# EAGLE design W500A (EAGLE 6.6.0)
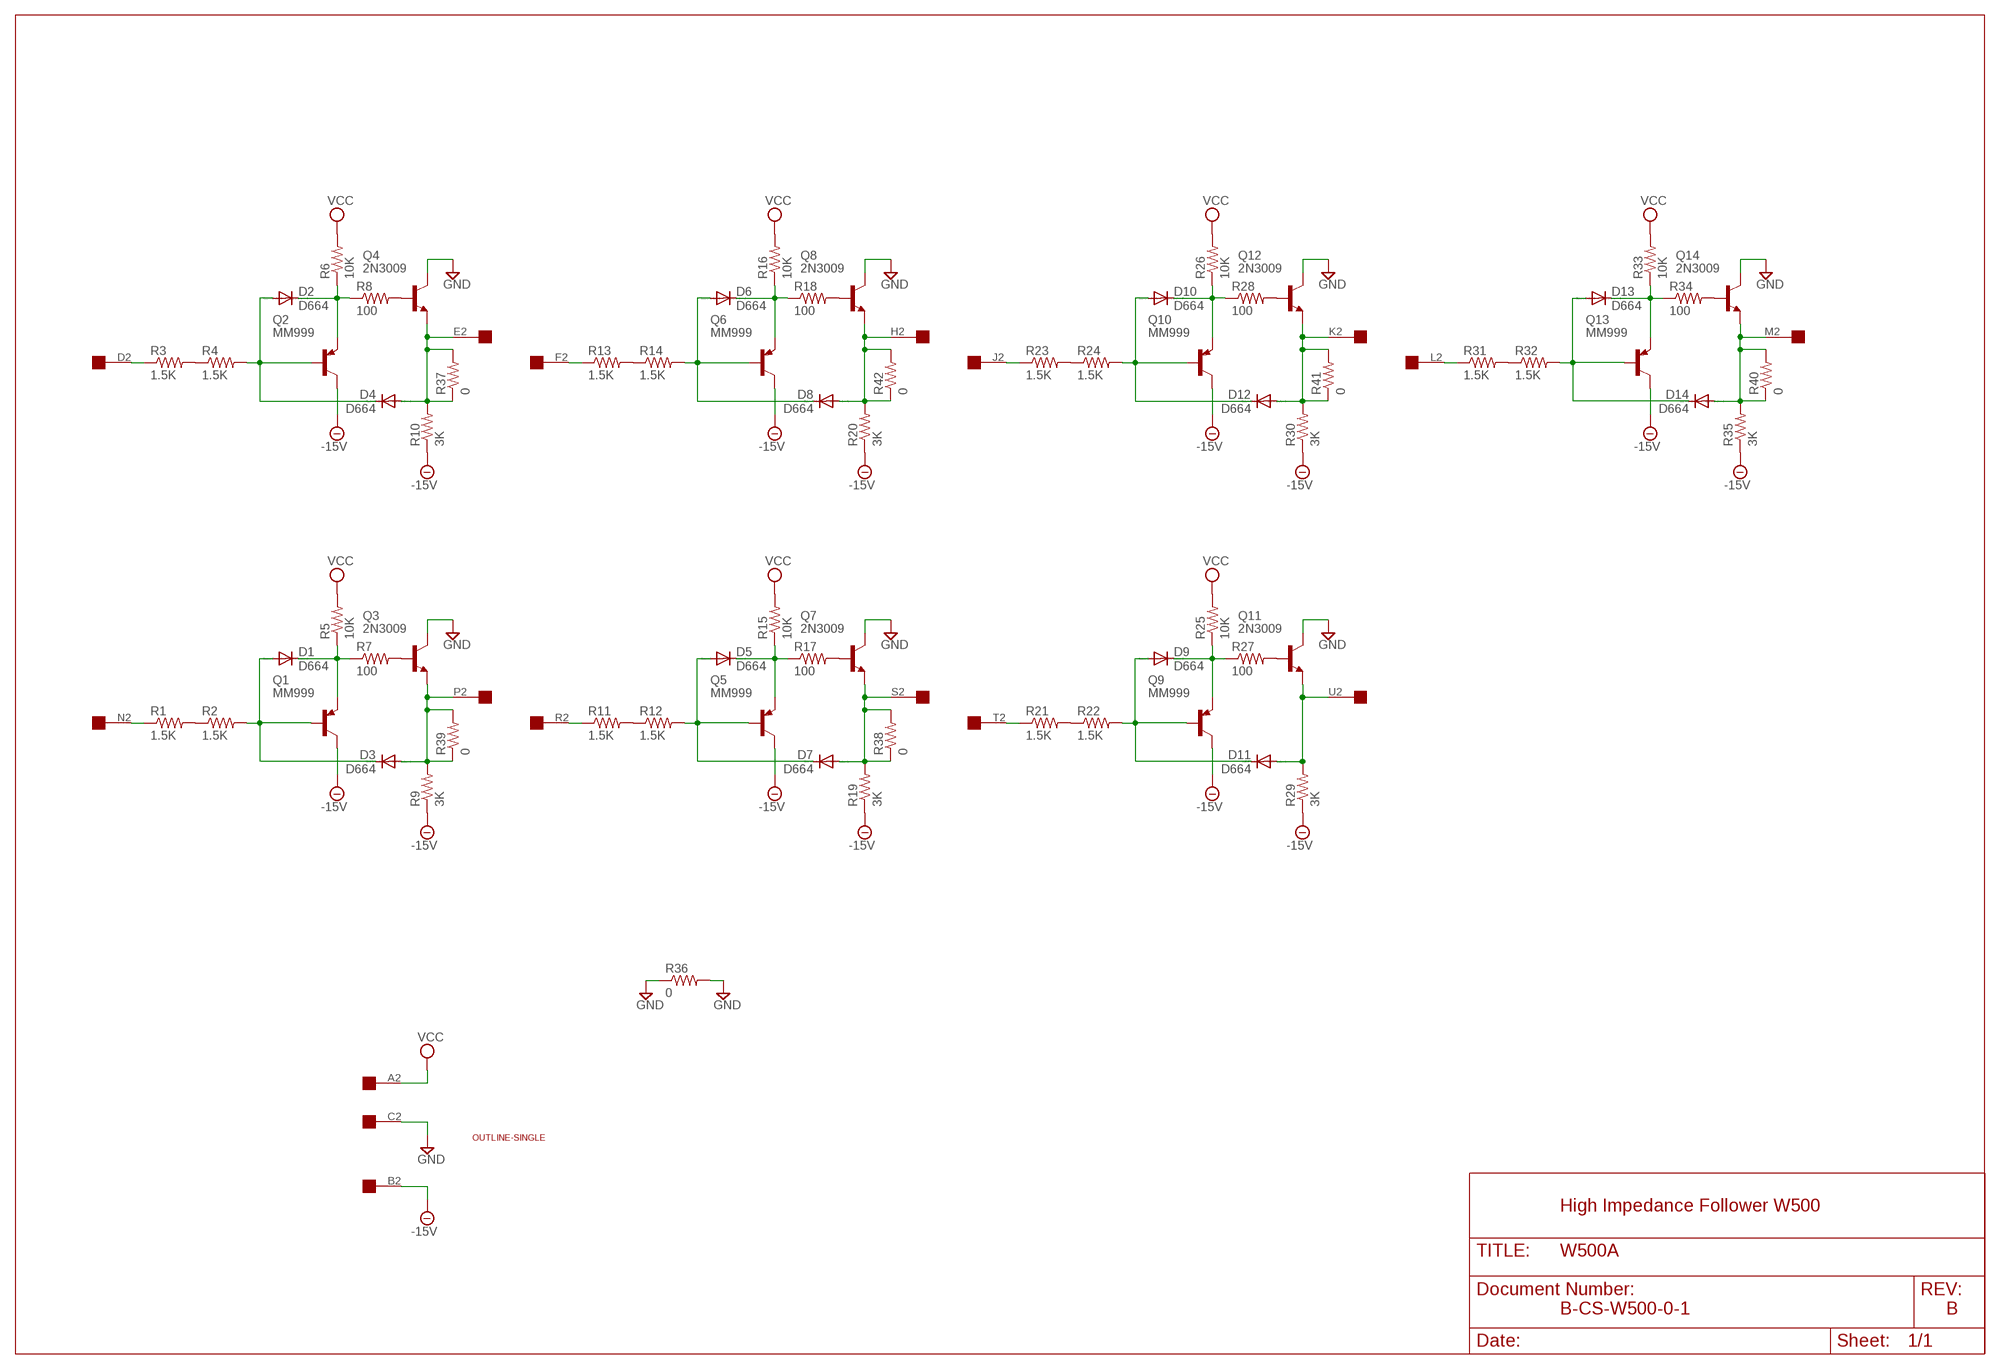
[diagram p0: schematic, sheet 1]

## Parts
D1  D664  DIODE-DO35-10  [DO35-10]
D2  D664  DIODE-DO35-10  [DO35-10]
D3  D664  DIODE-DO35-10  [DO35-10]
D4  D664  DIODE-DO35-10  [DO35-10]
D5  D664  DIODE-DO35-10  [DO35-10]
D6  D664  DIODE-DO35-10  [DO35-10]
D7  D664  DIODE-DO35-10  [DO35-10]
D8  D664  DIODE-DO35-10  [DO35-10]
D9  D664  DIODE-DO35-10  [DO35-10]
D10  D664  DIODE-DO35-10  [DO35-10]
D11  D664  DIODE-DO35-10  [DO35-10]
D12  D664  DIODE-DO35-10  [DO35-10]
D13  D664  DIODE-DO35-10  [DO35-10]
D14  D664  DIODE-DO35-10  [DO35-10]
Q1  MM999  -PNP-TO5  [TO5]
Q2  MM999  -PNP-TO5  [TO5]
Q3  2N3009  -NPN-TO5  [TO5]
Q4  2N3009  -NPN-TO5  [TO5]
Q5  MM999  -PNP-TO5  [TO5]
Q6  MM999  -PNP-TO5  [TO5]
Q7  2N3009  -NPN-TO5  [TO5]
Q8  2N3009  -NPN-TO5  [TO5]
Q9  MM999  -PNP-TO5  [TO5]
Q10  MM999  -PNP-TO5  [TO5]
Q11  2N3009  -NPN-TO5  [TO5]
Q12  2N3009  -NPN-TO5  [TO5]
Q13  MM999  -PNP-TO5  [TO5]
Q14  2N3009  -NPN-TO5  [TO5]
R1  1.5K  R-US_0207/10  [0207/10]
R2  1.5K  R-US_0207/10  [0207/10]
R3  1.5K  R-US_0207/10  [0207/10]
R4  1.5K  R-US_0207/10  [0207/10]
R5  10K  R-US_0207/10  [0207/10]
R6  10K  R-US_0207/10  [0207/10]
R7  100  R-US_0207/10  [0207/10]
R8  100  R-US_0207/10  [0207/10]
R9  3K  R-US_0207/10  [0207/10]
R10  3K  R-US_0207/10  [0207/10]
R11  1.5K  R-US_0207/10  [0207/10]
R12  1.5K  R-US_0207/10  [0207/10]
R13  1.5K  R-US_0207/10  [0207/10]
R14  1.5K  R-US_0207/10  [0207/10]
R15  10K  R-US_0207/10  [0207/10]
R16  10K  R-US_0207/10  [0207/10]
R17  100  R-US_0207/10  [0207/10]
R18  100  R-US_0207/10  [0207/10]
R19  3K  R-US_0207/10  [0207/10]
R20  3K  R-US_0207/10  [0207/10]
R21  1.5K  R-US_0207/10  [0207/10]
R22  1.5K  R-US_0207/10  [0207/10]
R23  1.5K  R-US_0207/10  [0207/10]
R24  1.5K  R-US_0207/10  [0207/10]
R25  10K  R-US_0207/10  [0207/10]
R26  10K  R-US_0207/10  [0207/10]
R27  100  R-US_0207/10  [0207/10]
R28  100  R-US_0207/10  [0207/10]
R29  3K  R-US_0207/10  [0207/10]
R30  3K  R-US_0207/10  [0207/10]
R31  1.5K  R-US_0207/10  [0207/10]
R32  1.5K  R-US_0207/10  [0207/10]
R33  10K  R-US_0207/10  [0207/10]
R34  100  R-US_0207/10  [0207/10]
R35  3K  R-US_0207/10  [0207/10]
R36  0  R-US_0207/10  [0207/10]
R37  0  R-US_0207/10  [0207/10]
R38  0  R-US_0207/10  [0207/10]
R39  0  R-US_0207/10  [0207/10]
R40  0  R-US_0207/10  [0207/10]
R41  0  R-US_0207/10  [0207/10]
R42  0  R-US_0207/10  [0207/10]
U$1  OUTLINE-SINGLE  [SINGLE]
U$2  EDGE-1  [EDGE-CON1]

## Nets
-15V: Q1.3(C) Q2.3(C) Q5.3(C) Q6.3(C) Q9.3(C) Q10.3(C) Q13.3(C) R9.1 R10.1 R19.1 R20.1 R29.1 R30.1 R35.1 U$2.B2
GND: Q3.3(C) Q4.3(C) Q7.3(C) Q8.3(C) Q11.3(C) Q12.3(C) Q14.3(C) R36.1 R36.2 U$2.C2
N$1: D2.C Q2.1(E) R6.1 R8.1
N$2: D2.A D4.C Q2.2(B) R4.2
N$3: R3.2 R4.1
N$4: R3.1 U$2.D2
N$5: Q4.2(B) R8.2
N$6: D4.A Q4.1(E) R10.2 R37.1 R37.2 U$2.E2
N$7: R1.2 R2.1
N$8: R1.1 U$2.N2
N$9: D1.A D3.C Q1.2(B) R2.2
N$10: D1.C Q1.1(E) R5.1 R7.1
N$11: D3.A Q3.1(E) R9.2 R39.1 R39.2 U$2.P2
N$12: Q3.2(B) R7.2
N$13: D6.C Q6.1(E) R16.1 R18.1
N$14: D6.A D8.C Q6.2(B) R14.2
N$15: R13.2 R14.1
N$16: R13.1 U$2.F2
N$17: Q8.2(B) R18.2
N$18: D8.A Q8.1(E) R20.2 R42.1 R42.2 U$2.H2
N$19: R11.2 R12.1
N$20: R11.1 U$2.R2
N$21: D5.A D7.C Q5.2(B) R12.2
N$22: D5.C Q5.1(E) R15.1 R17.1
N$23: D7.A Q7.1(E) R19.2 R38.1 R38.2 U$2.S2
N$24: Q7.2(B) R17.2
N$25: D10.C Q10.1(E) R26.1 R28.1
N$26: D10.A D12.C Q10.2(B) R24.2
N$27: R23.2 R24.1
N$28: R23.1 U$2.J2
N$29: Q12.2(B) R28.2
N$30: D12.A Q12.1(E) R30.2 R41.1 R41.2 U$2.K2
N$31: R21.2 R22.1
N$33: D9.A D11.C Q9.2(B) R22.2
N$34: D9.C Q9.1(E) R25.1 R27.1
N$35: D11.A Q11.1(E) R29.2 U$2.U2
N$36: Q11.2(B) R27.2
N$37: R21.1 U$2.T2
N$43: R31.2 R32.1
N$44: R31.1 U$2.L2
N$45: D13.A D14.C Q13.2(B) R32.2
N$46: D13.C Q13.1(E) R33.1 R34.1
N$47: D14.A Q14.1(E) R35.2 R40.1 R40.2 U$2.M2
N$48: Q14.2(B) R34.2
VCC: R5.2 R6.2 R15.2 R16.2 R25.2 R26.2 R33.2 U$2.A2
Unconnected: U$2.V2

## Notes on the sheet
- High Impedance Follower W500
- B-CS-W500-0-1 | B

## Library data of the parts
D1-D14 = diode:DIODE-: DIODE
Q1 Q2 Q5 Q6 Q9 Q10 Q13 = transistor:*-PNP-: PNP Transistror
Q3 Q4 Q7 Q8 Q11 Q12 Q14 = transistor:*-NPN-: NPN Transistror BF959 corrected 2008.03.06
R1-R42 = rcl:R-US_: RESISTOR, American symbol
U$1 = dec-con:OUTLINE-*: Board outlines for DEC boards.
U$2 = dec-con:EDGE-1: Single-Sided DEC Edge Connector -- (side 2)

## Board
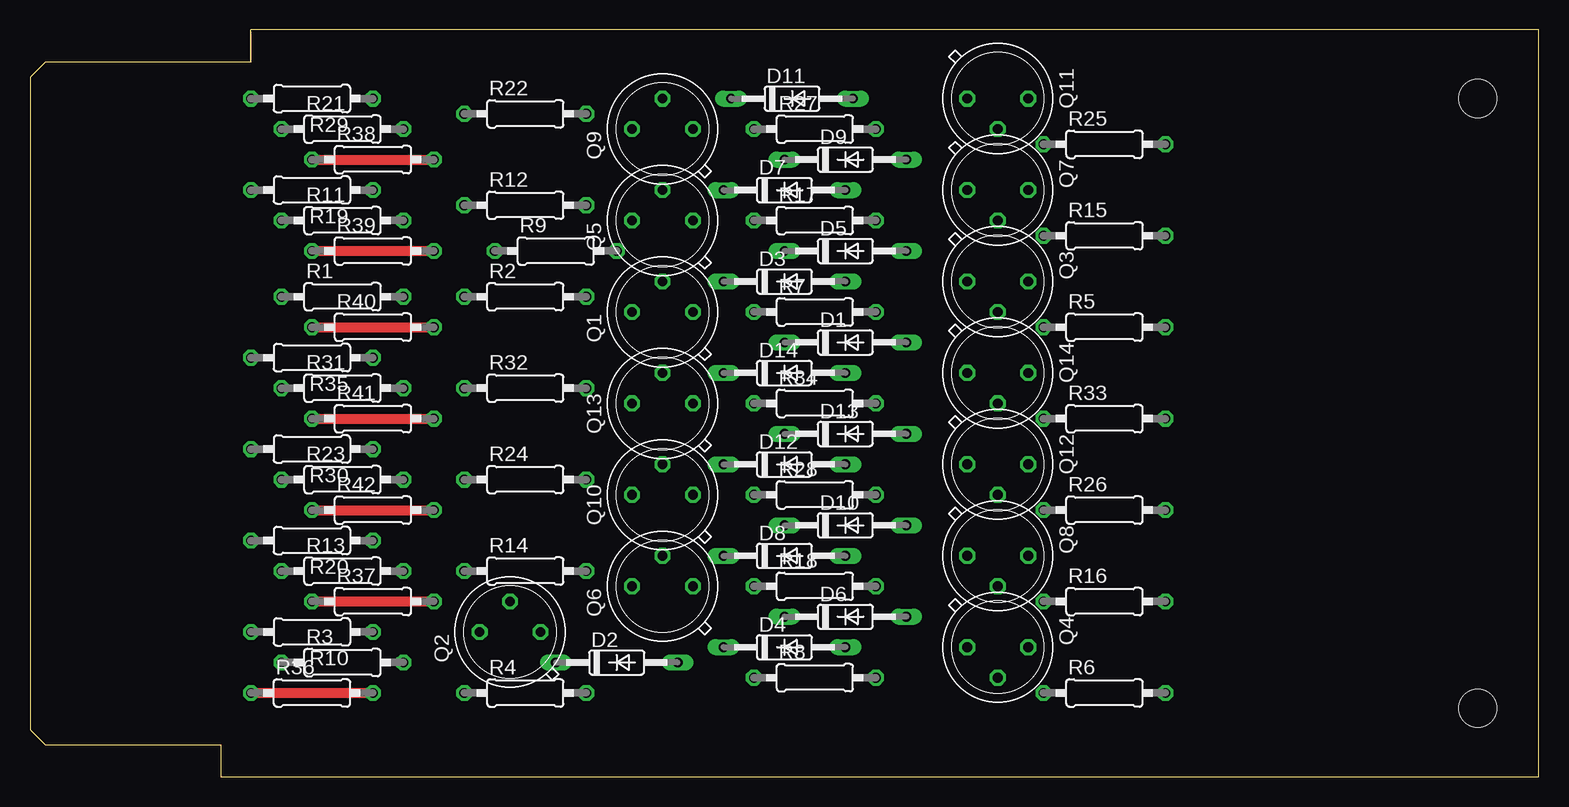
[diagram p1: board, top side]
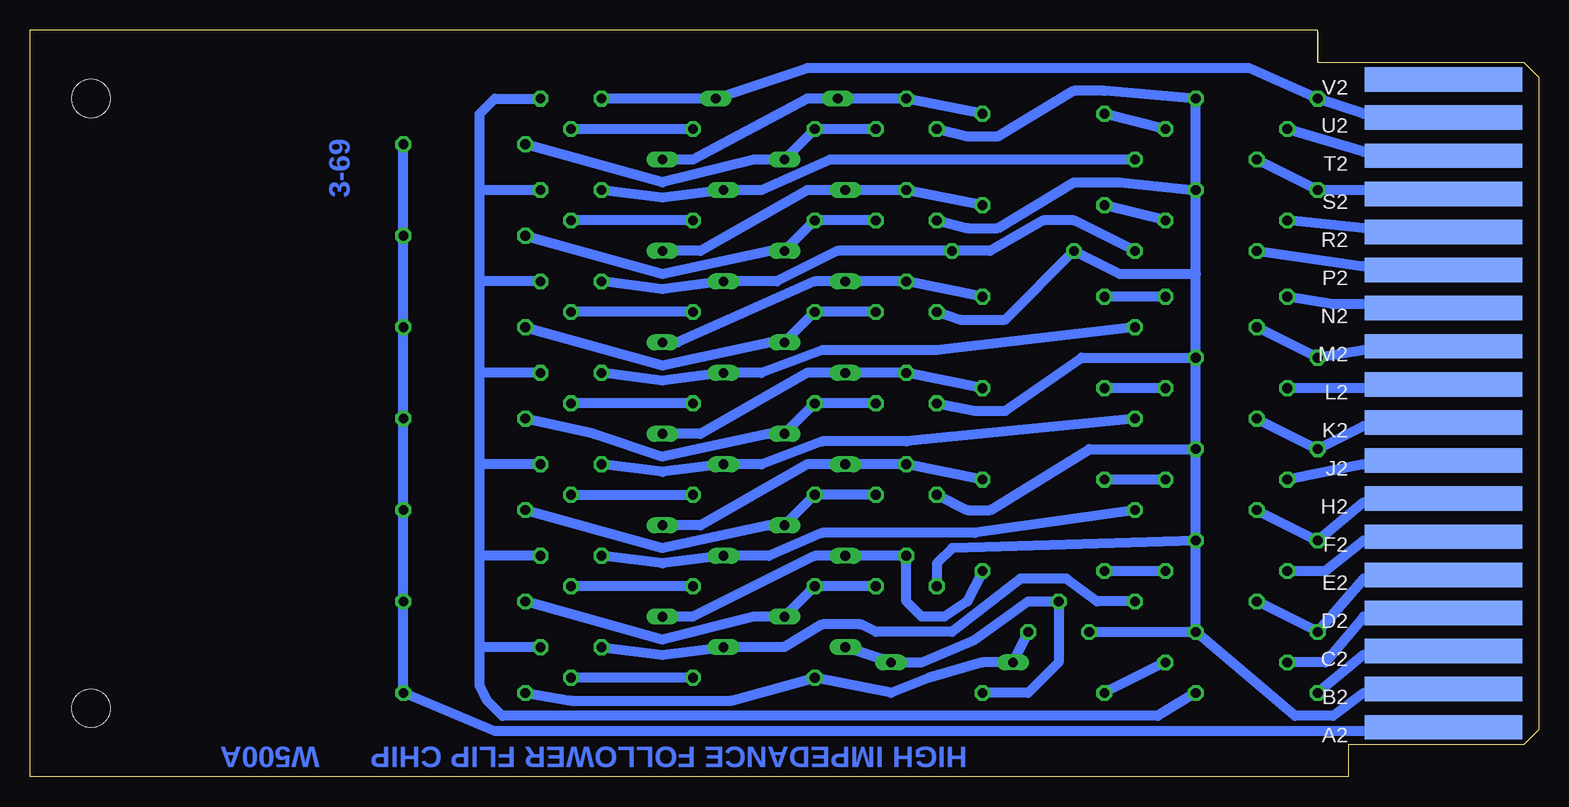
[diagram p2: board, bottom side, seen from below]

Size 125.73 x 62.23 mm. Coordinates in mm from the lower left corner, seen from the top.
Copper layers (1+16): Top 0.035mm / dielectric 1.5mm / Bottom 0.035mm
Design rules "16mils": minimum track width 16mil, minimum drill 32mil, track to track 15mil, track to pad 10mil, pad to pad 10mil, via to via 10mil, smd to smd 10mil, copper to edge 13mil, drill to drill 10mil, minimum pad ring 10mil, minimum via ring 8mil, stop-mask expansion 0mil, vias tented up to drill 0mil, thermal gap 10mil

### Footprints (pad centres in the part's own frame; a part is rotated, then mirrored left to right if it is on the bottom)
DO35-10 = drill 0.813 long: A 5.08,0; C -5.08,0
TO5 = drill 0.813 octagon: 1 0,-2.54; 2 2.54,0; 3 0,2.54
0207/10 = drill 0.813 octagon: 1 -5.08,0; 2 5.08,0
SINGLE = hole 3.175: 120.65,56.515; 120.65,5.715
EDGE-CON1 = smd 13.106 x 2.032 bottom: A2 7.938,4.128; B2 7.938,7.303; C2 7.938,10.477; D2 7.938,13.652; E2 7.938,16.828; F2 7.938,20.003; H2 7.938,23.177; J2 7.938,26.352; K2 7.938,29.527; L2 7.938,32.703; M2 7.938,35.877; N2 7.938,39.053; P2 7.938,42.227; R2 7.938,45.403; S2 7.938,48.578; T2 7.938,51.752; U2 7.938,54.928; V2 7.938,58.102

### Placement (x,y rotation side)
D1  67.95,36.2 0 top
D2  48.9,9.53 0 top
D3  62.87,41.27 0 top
D4  62.87,10.79 0 top
D5  67.95,43.81 0 top
D6  67.95,13.34 0 top
D7  62.87,48.9 0 top
D8  62.87,18.41 0 top
D9  67.95,51.44 0 top
D10  67.95,20.95 0 top
D11  63.5,56.52 0 top
D12  62.87,26.04 0 top
D13  67.95,28.57 0 top
D14  62.87,33.66 0 top
Q1  52.71,38.73 90 top
Q2  40.01,12.06 90 top
Q3  80.65,41.27 270 top
Q4  80.65,10.79 270 top
Q5  52.71,46.35 90 top
Q6  52.71,15.88 90 top
Q7  80.65,48.9 270 top
Q8  80.65,18.41 270 top
Q9  52.71,53.98 90 top
Q10  52.71,23.5 90 top
Q11  80.65,56.52 270 top
Q12  80.65,26.04 270 top
Q13  52.71,31.11 90 top
Q14  80.65,33.66 270 top
R1  26.04,40.01 0 top
R2  41.28,40.01 0 top
R3  26.04,9.53 0 top
R4  41.28,6.99 0 top
R5  89.54,37.47 0 top
R6  89.54,6.99 0 top
R7  65.41,38.73 0 top
R8  65.41,8.26 0 top
R9  43.82,43.81 0 top
R10  23.5,12.06 180 top
R11  26.04,46.35 0 top
R12  41.28,47.62 0 top
R13  26.04,17.14 0 top
R14  41.28,17.14 0 top
R15  89.54,45.09 0 top
R16  89.54,14.61 0 top
R17  65.41,46.35 0 top
R18  65.41,15.88 0 top
R19  23.5,48.9 180 top
R20  23.5,19.68 180 top
R21  26.04,53.98 0 top
R22  41.28,55.24 0 top
R23  26.04,24.77 0 top
R24  41.28,24.77 0 top
R25  89.54,52.7 0 top
R26  89.54,22.23 0 top
R27  65.41,53.98 0 top
R28  65.41,23.5 0 top
R29  23.5,56.52 180 top
R30  23.5,27.3 180 top
R31  26.04,32.38 0 top
R32  41.28,32.38 0 top
R33  89.54,29.84 0 top
R34  65.41,31.11 0 top
R35  23.5,34.92 180 top
R36  23.5,6.99 0 top
R37  28.58,14.61 0 top
R38  28.58,51.44 0 top
R39  28.58,43.81 0 top
R40  28.58,37.47 0 top
R41  28.58,29.84 0 top
R42  28.58,22.23 0 top
U$1  0,0 0 top
U$2  0,0 0 top

### Tracks (layer width: path | path; a pad name or v marks a point on that pad's centre or on a via)
-15V
  Bottom 0.813: U$2.B2 10.8,6.99 14.61,6.99 17.15,5.08 20.32,5.08 R10.1 | Q2.3 R10.1 | R10.1 R20.1 | R20.1 R30.1 | R30.1 R35.1 | R35.1 28.58,41.91 | 28.58,41.91 R19.1 | R19.1 R29.1 36.2,57.15 38.74,57.15 45.09,53.34 47.63,53.34 Q9.3 | Q1.3 48.26,38.1 44.45,38.1 R9.1 34.93,41.91 28.58,41.91 | R20.1 48.9,19.05 50.17,17.78 Q6.3 | Q13.3 46.99,30.48 44.45,30.48 38.1,34.92 R35.1 | Q5.3 47.63,45.72 45.09,45.72 38.74,49.53 34.93,49.53 R19.1 | Q10.3 47.63,22.23 45.72,22.23 37.47,27.3 R30.1
GND
  Top 0.813: R36.1 R36.2
  Bottom 0.813: U$2.C2 8.89,10.16 14.61,10.16 R36.1 | R36.2 31.75,5.08 86.36,5.08 87.63,6.35 88.27,7.62 88.27,10.79 | 88.27,10.79 88.27,18.41 | 88.27,18.41 88.27,26.04 | 88.27,26.04 88.27,33.66 | 88.27,33.66 88.27,41.27 | 88.27,41.27 88.27,48.9 | 88.27,48.9 88.27,55.24 87,56.52 Q11.3 | Q4.3 88.27,10.79 | Q3.3 88.27,41.27 | Q7.3 88.27,48.9 | Q14.3 88.27,33.66 | Q12.3 88.27,26.04 | Q8.3 88.27,18.41
N$1
  Bottom 0.813: Q2.1 D2.C 46.36,9.53 50.8,8.26 53.98,6.99 R8.1 67.31,6.35 80.65,6.35 R6.1
N$2
  Bottom 0.813: R4.2 42.55,6.99 40.01,9.53 Q2.2 42.55,14.61 46.99,11.43 51.44,9.53 D2.A D4.C
N$3
  Bottom 0.813: R3.2 R4.1
N$4
  Bottom 0.813: U$2.D2 8.89,13.34 14.61,13.34 17.78,9.53 R3.1
N$5
  Bottom 0.813: R8.2 Q4.2
N$6
  Top 0.813: R37.1 R37.2
  Bottom 0.813: Q4.1 73.03,10.16 D4.A 62.87,10.79 59.69,12.7 56.52,12.7 55.25,12.06 48.9,12.06 43.18,16.51 39.37,16.51 36.83,14.61 R37.2 | U$2.E2 14.61,16.51 R10.2 R37.1
N$7
  Bottom 0.813: R1.2 R2.1
N$8
  Bottom 0.813: U$2.N2 8.89,39.37 17.15,39.37 R1.1
N$9
  Bottom 0.813: D1.A 71.76,36.2 60.33,41.27 D3.C Q1.2 R2.2
N$10
  Bottom 0.813: R5.1 73.03,34.29 64.14,36.2 D1.C R7.1 Q1.1
N$11
  Top 0.813: R39.1 R39.2
  Bottom 0.813: Q3.1 73.03,40.64 D3.A 63.5,41.27 58.42,43.81 R9.2 45.72,43.81 41.28,46.35 38.74,46.35 R39.2 | R39.1 14.61,42.55 8.89,42.55 U$2.P2
N$12
  Bottom 0.813: R7.2 Q3.2
N$13
  Bottom 0.813: Q6.1 R18.1 D6.C 65.41,13.34 73.03,11.43 R16.1
N$14
  Bottom 0.813: R14.2 47.63,14.61 49.53,13.34 51.44,13.34 52.71,14.61 Q6.2 D8.C 60.33,18.41 70.49,13.34 D6.A
N$15
  Bottom 0.813: R13.2 R14.1
N$16
  Bottom 0.813: U$2.F2 8.89,19.68 14.61,19.68 17.78,17.14 R13.1
N$17
  Bottom 0.813: R18.2 Q8.2
N$18
  Top 0.813: R42.1 R42.2
  Bottom 0.813: U$2.H2 8.89,22.86 14.61,22.86 R20.2 R42.1 | Q8.1 73.03,17.78 D8.A 64.14,18.41 59.69,20.32 46.99,20.32 R42.2
N$19
  Bottom 0.813: R11.2 R12.1
N$20
  Bottom 0.813: U$2.R2 8.89,45.72 14.61,45.72 R11.1
N$21
  Bottom 0.813: R12.2 Q5.2 D7.C 60.96,48.9 69.85,43.81 D5.A
N$22
  Bottom 0.813: Q5.1 R17.1 D5.C 64.14,43.81 73.03,41.91 R15.1
N$23
  Top 0.813: R38.1 R38.2
  Bottom 0.813: U$2.S2 8.89,48.9 R19.2 R38.1 | R38.2 59.06,51.44 64.77,48.9 D7.A 73.03,48.26 Q7.1
N$24
  Bottom 0.813: R17.2 Q7.2
N$25
  Bottom 0.813: Q10.1 R28.1 D10.C 64.14,20.95 73.03,19.05 R26.1
N$26
  Bottom 0.813: R24.2 Q10.2 D12.C 60.96,26.04 69.85,20.95 D10.A
N$27
  Bottom 0.813: R23.2 R24.1
N$28
  Bottom 0.813: U$2.J2 8.89,26.04 14.61,26.04 R23.1
N$29
  Bottom 0.813: Q12.2 R28.2
N$30
  Top 0.813: R41.1 R41.2
  Bottom 0.813: U$2.K2 8.89,29.21 14.61,29.21 R30.2 R41.1 | Q12.1 73.03,25.4 D12.A 64.77,26.04 59.69,27.94 52.71,27.94 R41.2
N$31
  Bottom 0.813: R21.2 R22.1
N$33
  Bottom 0.813: R22.2 Q9.2 D11.C 60.96,56.52 70.49,51.44 D9.A
N$34
  Bottom 0.813: Q9.1 R27.1 D9.C 65.41,51.44 73.03,49.53 R25.1
N$35
  Bottom 0.813: U$2.U2 8.89,55.24 14.61,55.24 R29.2 24.13,59.05 60.96,59.05 D11.A Q11.1
N$36
  Bottom 0.813: R27.2 Q11.2
N$37
  Bottom 0.813: U$2.T2 8.89,52.07 14.61,52.07 R21.1
N$43
  Bottom 0.813: R31.2 R32.1
N$44
  Bottom 0.813: U$2.L2 8.89,32.38 R31.1
N$45
  Bottom 0.813: R32.2 Q13.2 D14.C 60.96,33.66 69.85,28.57 D13.A
N$46
  Bottom 0.813: Q13.1 R34.1 D13.C 64.14,28.57 73.03,26.67 78.74,28.57 R33.1
N$47
  Top 0.813: R40.1 R40.2
  Bottom 0.813: U$2.M2 8.89,35.56 14.61,35.56 R35.2 R40.1 | R40.2 50.17,35.56 59.69,35.56 64.77,33.66 D14.A 73.03,33.02 Q14.1
N$48
  Bottom 0.813: R34.2 Q14.2
VCC
  Bottom 0.813: U$2.A2 8.89,3.81 87,3.81 R6.2 R16.2 R26.2 R33.2 R5.2 R15.2 R25.2

### Text on the board
Bottom: 3-69 | HIGH IMPEDANCE FOLLOWER FLIP CHIP | W500A
200bmp: C:/Users/Vince/Documents/eagle/projects/DEC/Wxxx/W500/W500Abackfb.bmp